# EAGLE design RockBlock_Breakout (EAGLE 9.2.1)
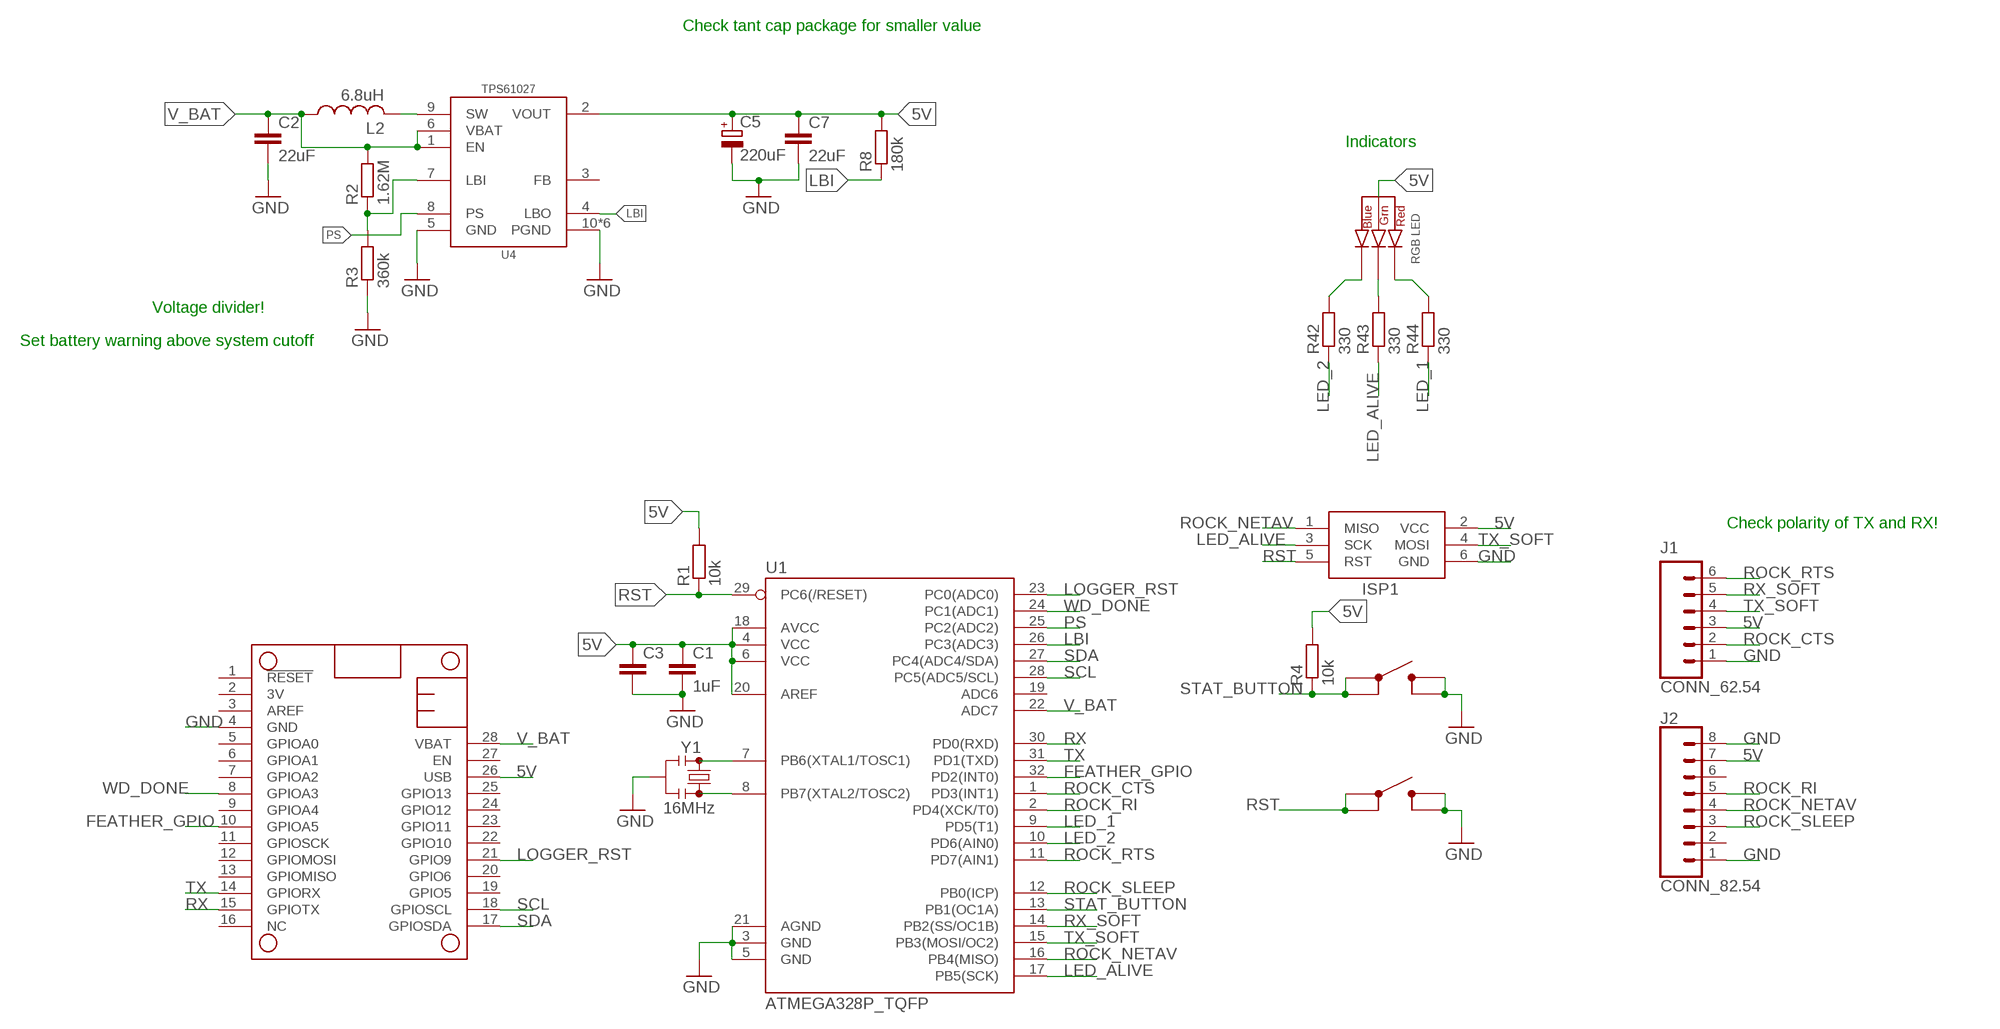
[diagram p0: schematic, sheet 1]

## Parts
C1  1uF  C-EUC0603  [C0603]
C2  22uF  C-EU22UFC0805  [C0805]
C3  C-EUC0402  [C0402]
C5  220uF  CTANT_EU2917  [C2917]
C7  22uF  C-EU22UFC0805  [C0805]
D5  CLVBA-FKA  [CLVBA-FKA]
ISP1  AVRISP-6  [AVRISP]
J1  CONN_62.54  [1X06]
J2  CONN_82.54  [1X08]
L2  6.8uH  INDUCTORTPC_4.8X4.8  [WE-TPC(4.8X4.8)]
MS1  FEATHERWINGLAYOUT  [FEATHERWING_MIN]
R1  10k  R-EU_R0402  [R0402]
R2  1.62M  R-EU_1.62MR0603  [R0603]
R3  360k  R-EU_360KR0603  [R0603]
R4  10k  R-EU_R0402  [R0402]
R8  180k  R-EU_180KR0603  [R0603]
R42  330  R-EU_330R0402  [R0402]
R43  330  R-EU_330R0402  [R0402]
R44  330  R-EU_330R0402  [R0402]
S1  BUTTON4.2X3.2  [SWITCH_4.2X3.2]
S2  BUTTON4.2X3.2  [SWITCH_4.2X3.2]
U1  ATMEGA328P_TQFP  [TQFP32-08]
U4  TPS61027DRC  [DRC0010J]
Y1  16MHz  RESONATOR16MHZSMD_3.2X1.3  [RESONATOR-SMD-3.2X1.3]

## Nets
5V: C1.1 C3.1 C5.+ C7.1 D5.2(ANODE) ISP1.2(VCC) J1.3 J2.7 MS1.26(USB) R1.2 R4.2 R8.2 U1.4(VCC) U1.6(VCC) U1.18(AVCC) U1.20(AREF) U4.2(VOUT)
FEATHER_GPIO: MS1.10(GPIOA5) U1.32(PD2(INT0))
GND: C1.2 C2.2 C3.2 C5.- C7.2 ISP1.6(GND) J1.1 J2.1 J2.8 MS1.4(GND) R3.1 S1.3 S1.4 S2.3 S2.4 U1.3(GND) U1.5(GND) U1.21(AGND) U4.5(GND) U4.10(PGND) U4.EP@1(PGND) U4.EP@2(PGND) U4.EP@3(PGND) U4.EP@4(PGND) U4.EP@5(PGND) Y1.2
LBI: R8.1 U1.26(PC3(ADC3)) U4.4(LBO)
LED_1: R44.1 U1.9(PD5(T1))
LED_2: R42.1 U1.10(PD6(AIN0))
LED_ALIVE: ISP1.3(SCK) R43.1 U1.17(PB5(SCK))
LOGGER_RST: MS1.21(GPIO9) U1.23(PC0(ADC0))
N$2: U1.7(PB6(XTAL1/TOSC1)) Y1.1
N$3: U1.8(PB7(XTAL2/TOSC2)) Y1.3
N$4: R2.1 R3.2 U4.7(LBI)
N$5: L2.2 U4.9(SW)
N$58: D5.3(BLUE_CATH) R42.2
N$59: D5.4(GREEN_CATH) R43.2
N$60: D5.1(RED_CATH) R44.2
PS: U1.25(PC2(ADC2)) U4.8(PS)
ROCK_CTS: J1.2 U1.1(PD3(INT1))
ROCK_NETAV: ISP1.1(MISO) J2.4 U1.16(PB4(MISO))
ROCK_RI: J2.5 U1.2(PD4(XCK/T0))
ROCK_RTS: J1.6 U1.11(PD7(AIN1))
ROCK_SLEEP: J2.3 U1.12(PB0(ICP))
RST: ISP1.5(RST) R1.1 S2.1 S2.2 U1.29(PC6(/RESET))
RX: MS1.15(GPIOTX) U1.30(PD0(RXD))
RX_SOFT: J1.5 U1.14(PB2(SS/OC1B))
SCL: MS1.18(GPIOSCL) U1.28(PC5(ADC5/SCL))
SDA: MS1.17(GPIOSDA) U1.27(PC4(ADC4/SDA))
STAT_BUTTON: R4.1 S1.1 S1.2 U1.13(PB1(OC1A))
TX: MS1.14(GPIORX) U1.31(PD1(TXD))
TX_SOFT: ISP1.4(MOSI) J1.4 U1.15(PB3(MOSI/OC2))
V_BAT: C2.1 L2.1 MS1.28(VBAT) R2.2 U1.22(ADC7) U4.1(EN) U4.6(VBAT)
WD_DONE: MS1.8(GPIOA3) U1.24(PC1(ADC1))
Unconnected: J2.2 J2.6 MS1.1(!RESET) MS1.2(3V) MS1.3(AREF) MS1.5(GPIOA0) MS1.6(GPIOA1) MS1.7(GPIOA2) MS1.9(GPIOA4) MS1.11(GPIOSCK) MS1.12(GPIOMOSI) MS1.13(GPIOMISO) MS1.16(NC) MS1.19(GPIO5) MS1.20(GPIO6) MS1.22(GPIO10) MS1.23(GPIO11) MS1.24(GPIO12) MS1.25(GPIO13) MS1.27(EN) U1.19(ADC6) U4.3(FB)

## Notes on the sheet
- Check tant cap package for smaller value
- Indicators
- Voltage divider!
- Set battery warning above system cutoff
- Check polarity of TX and RX!

## Library data of the parts
C1 C3 = bschulz_passives:C-EU: CAPACITOR, European symbol
C2 C7 = bschulz_passives:C-EU: CAPACITOR, European symbol; DIGIKEY: 490-9952-1-ND; MF: Murata; MPN: GRM219R61C226ME15L
C5 = bschulz_passives:CTANT_EU: Genaric Tantalum Capacitor; DIGIKEY: 478-5408-1-ND; MF: AVX; MPN: TPSY227K010R0100
D5 = bschulz:CLVBA-FKA: Cree RGB LED, Small Package, Common Anode, CLVBA-FKA Digikey: https://www.digikey.com/product-detail/en/cree-inc/CLVBA-FKA-CAEDH8BBB7A363/CLVBA-FKA-CAEDH8BBB7A363CT-ND/2650500; DIGIKEY: CLVBA-FKA-CAEDH8BBB7A363CT-ND; MF: Cree; MPN: CLVBA-FKA-CAEDH8BBB7A363
ISP1 = bschulz:AVRISP: AVR ISP HEADER Standard 6 pin header for AVR programming
J1 = bschulz:CONN_6: Genaric 6 pin header
J2 = bschulz:CONN_8: Genaric 8 pin header
L2 = bschulz:INDUCTOR: Genaric inductor; DIGIKEY: 732-1023-1-ND; MF: Wurth; MPN: 744042006
MS1 = bschulz:FEATHERWING
R1 R4 = bschulz_passives:R-EU_: RESISTOR, European symbol Digikey Parts: Yageo, 0402 <https://www.digikey.com/products/en/resistors/chip-resistor-surface-mount/52?k=&pkeyword=&sf=0&FV=ffec1104%2Cfffc000d%2C1c0002%2C440067%2C1f140000%2Cffe00034%2C400004&quantity=&ColumnSort=0&page=1&stock=1&pageSize=25> Yageo, 0603 <https://www.digikey.com/products/en/resistors/chip-resistor-surface-mount/52?k=&pkeyword=&s=4356&s=47360&sf=0&FV=fffc000d%2C1c0002%2C142c040c%2C1f140000%2Cffe00034&quantity=10&ColumnSort=1000011&page=1&stock=1&pageSize=25> Panasonic, 0603 <https://www.digikey.com/products/en/resistors/chip-resistor-surface-mount/52?k=&pkeyword=&pv252=68&sf=0&FV=ffec373d%2C1c0002%2C142c040c%2C1f140000%2Cffe00034%2C80002%2Cc0001&quantity=&ColumnSort=0&page=1&stock=1&pageSize=25> Panasonic, precision, 0603 <https://www.digikey.com/products/en/resistors/chip-resistor-surface-mount/52?FV=ffec4907%2Cfffc000a%2Cc0172%2C142c040c%2C1f140000%2Cffe00034%2C1c0002&quantity=100&ColumnSort=2085&page=1&stock=1&pageSize=25> Panasonic, 0805 <https://www.digikey.com/products/en/resistors/chip-resistor-surface-mount/52?k=&pkeyword=&pv3=1&sf=0&FV=ffec373d%2C1c0002%2C1f140000%2Cffe00034%2C142c040d&quantity=&ColumnSort=0&page=1&stock=1&pageSize=25> Rohm, current sense <https://www.digikey.com/products/en/resistors/chip-resistor-surface-mount/52?k=&pkeyword=&pv3=1&sf=0&FV=ffecb688%2C1f140000%2Cffe00034%2C1c0002&quantity=&ColumnSort=0&page=1&stock=1&pageSize=25> Vishay, pulse proof automotive <https://www.digikey.com/products/en/resistors/chip-resistor-surface-mount/52?k=&pkeyword=&pv7=2&sf=0&FV=ffec5d6b%2Cffe00034%2C1f140000&quantity=&ColumnSort=0&page=1&stock=1&pageSize=25>; MF: Yageo
R2 = bschulz_passives:R-EU_: RESISTOR, European symbol Digikey Parts: Yageo, 0402 <https://www.digikey.com/products/en/resistors/chip-resistor-surface-mount/52?k=&pkeyword=&sf=0&FV=ffec1104%2Cfffc000d%2C1c0002%2C440067%2C1f140000%2Cffe00034%2C400004&quantity=&ColumnSort=0&page=1&stock=1&pageSize=25> Yageo, 0603 <https://www.digikey.com/products/en/resistors/chip-resistor-surface-mount/52?k=&pkeyword=&s=4356&s=47360&sf=0&FV=fffc000d%2C1c0002%2C142c040c%2C1f140000%2Cffe00034&quantity=10&ColumnSort=1000011&page=1&stock=1&pageSize=25> Panasonic, 0603 <https://www.digikey.com/products/en/resistors/chip-resistor-surface-mount/52?k=&pkeyword=&pv252=68&sf=0&FV=ffec373d%2C1c0002%2C142c040c%2C1f140000%2Cffe00034%2C80002%2Cc0001&quantity=&ColumnSort=0&page=1&stock=1&pageSize=25> Panasonic, precision, 0603 <https://www.digikey.com/products/en/resistors/chip-resistor-surface-mount/52?FV=ffec4907%2Cfffc000a%2Cc0172%2C142c040c%2C1f140000%2Cffe00034%2C1c0002&quantity=100&ColumnSort=2085&page=1&stock=1&pageSize=25> Panasonic, 0805 <https://www.digikey.com/products/en/resistors/chip-resistor-surface-mount/52?k=&pkeyword=&pv3=1&sf=0&FV=ffec373d%2C1c0002%2C1f140000%2Cffe00034%2C142c040d&quantity=&ColumnSort=0&page=1&stock=1&pageSize=25> Rohm, current sense <https://www.digikey.com/products/en/resistors/chip-resistor-surface-mount/52?k=&pkeyword=&pv3=1&sf=0&FV=ffecb688%2C1f140000%2Cffe00034%2C1c0002&quantity=&ColumnSort=0&page=1&stock=1&pageSize=25> Vishay, pulse proof automotive <https://www.digikey.com/products/en/resistors/chip-resistor-surface-mount/52?k=&pkeyword=&pv7=2&sf=0&FV=ffec5d6b%2Cffe00034%2C1f140000&quantity=&ColumnSort=0&page=1&stock=1&pageSize=25>; DIGIKEY: RMCF0603FT1M62CT-ND; MF: Stackpole; MPN: RMCF0603FT1M62; VALUE_PART: 1.62M
R3 = bschulz_passives:R-EU_: RESISTOR, European symbol Digikey Parts: Yageo, 0402 <https://www.digikey.com/products/en/resistors/chip-resistor-surface-mount/52?k=&pkeyword=&sf=0&FV=ffec1104%2Cfffc000d%2C1c0002%2C440067%2C1f140000%2Cffe00034%2C400004&quantity=&ColumnSort=0&page=1&stock=1&pageSize=25> Yageo, 0603 <https://www.digikey.com/products/en/resistors/chip-resistor-surface-mount/52?k=&pkeyword=&s=4356&s=47360&sf=0&FV=fffc000d%2C1c0002%2C142c040c%2C1f140000%2Cffe00034&quantity=10&ColumnSort=1000011&page=1&stock=1&pageSize=25> Panasonic, 0603 <https://www.digikey.com/products/en/resistors/chip-resistor-surface-mount/52?k=&pkeyword=&pv252=68&sf=0&FV=ffec373d%2C1c0002%2C142c040c%2C1f140000%2Cffe00034%2C80002%2Cc0001&quantity=&ColumnSort=0&page=1&stock=1&pageSize=25> Panasonic, precision, 0603 <https://www.digikey.com/products/en/resistors/chip-resistor-surface-mount/52?FV=ffec4907%2Cfffc000a%2Cc0172%2C142c040c%2C1f140000%2Cffe00034%2C1c0002&quantity=100&ColumnSort=2085&page=1&stock=1&pageSize=25> Panasonic, 0805 <https://www.digikey.com/products/en/resistors/chip-resistor-surface-mount/52?k=&pkeyword=&pv3=1&sf=0&FV=ffec373d%2C1c0002%2C1f140000%2Cffe00034%2C142c040d&quantity=&ColumnSort=0&page=1&stock=1&pageSize=25> Rohm, current sense <https://www.digikey.com/products/en/resistors/chip-resistor-surface-mount/52?k=&pkeyword=&pv3=1&sf=0&FV=ffecb688%2C1f140000%2Cffe00034%2C1c0002&quantity=&ColumnSort=0&page=1&stock=1&pageSize=25> Vishay, pulse proof automotive <https://www.digikey.com/products/en/resistors/chip-resistor-surface-mount/52?k=&pkeyword=&pv7=2&sf=0&FV=ffec5d6b%2Cffe00034%2C1f140000&quantity=&ColumnSort=0&page=1&stock=1&pageSize=25>; DIGIKEY: 311-360KHRCT-ND; MF: Yageo; MPN: RC0603FR-07360KL; VALUE_PART: 360k
R8 = bschulz_passives:R-EU_: RESISTOR, European symbol Digikey Parts: Yageo, 0402 <https://www.digikey.com/products/en/resistors/chip-resistor-surface-mount/52?k=&pkeyword=&sf=0&FV=ffec1104%2Cfffc000d%2C1c0002%2C440067%2C1f140000%2Cffe00034%2C400004&quantity=&ColumnSort=0&page=1&stock=1&pageSize=25> Yageo, 0603 <https://www.digikey.com/products/en/resistors/chip-resistor-surface-mount/52?k=&pkeyword=&s=4356&s=47360&sf=0&FV=fffc000d%2C1c0002%2C142c040c%2C1f140000%2Cffe00034&quantity=10&ColumnSort=1000011&page=1&stock=1&pageSize=25> Panasonic, 0603 <https://www.digikey.com/products/en/resistors/chip-resistor-surface-mount/52?k=&pkeyword=&pv252=68&sf=0&FV=ffec373d%2C1c0002%2C142c040c%2C1f140000%2Cffe00034%2C80002%2Cc0001&quantity=&ColumnSort=0&page=1&stock=1&pageSize=25> Panasonic, precision, 0603 <https://www.digikey.com/products/en/resistors/chip-resistor-surface-mount/52?FV=ffec4907%2Cfffc000a%2Cc0172%2C142c040c%2C1f140000%2Cffe00034%2C1c0002&quantity=100&ColumnSort=2085&page=1&stock=1&pageSize=25> Panasonic, 0805 <https://www.digikey.com/products/en/resistors/chip-resistor-surface-mount/52?k=&pkeyword=&pv3=1&sf=0&FV=ffec373d%2C1c0002%2C1f140000%2Cffe00034%2C142c040d&quantity=&ColumnSort=0&page=1&stock=1&pageSize=25> Rohm, current sense <https://www.digikey.com/products/en/resistors/chip-resistor-surface-mount/52?k=&pkeyword=&pv3=1&sf=0&FV=ffecb688%2C1f140000%2Cffe00034%2C1c0002&quantity=&ColumnSort=0&page=1&stock=1&pageSize=25> Vishay, pulse proof automotive <https://www.digikey.com/products/en/resistors/chip-resistor-surface-mount/52?k=&pkeyword=&pv7=2&sf=0&FV=ffec5d6b%2Cffe00034%2C1f140000&quantity=&ColumnSort=0&page=1&stock=1&pageSize=25>; DIGIKEY: P180KHCT-ND; MF: Panasonic; MPN: ERJ-3EKF1803V; VALUE_PART: 180k
R42-R44 = bschulz_passives:R-EU_: RESISTOR, European symbol Digikey Parts: Yageo, 0402 <https://www.digikey.com/products/en/resistors/chip-resistor-surface-mount/52?k=&pkeyword=&sf=0&FV=ffec1104%2Cfffc000d%2C1c0002%2C440067%2C1f140000%2Cffe00034%2C400004&quantity=&ColumnSort=0&page=1&stock=1&pageSize=25> Yageo, 0603 <https://www.digikey.com/products/en/resistors/chip-resistor-surface-mount/52?k=&pkeyword=&s=4356&s=47360&sf=0&FV=fffc000d%2C1c0002%2C142c040c%2C1f140000%2Cffe00034&quantity=10&ColumnSort=1000011&page=1&stock=1&pageSize=25> Panasonic, 0603 <https://www.digikey.com/products/en/resistors/chip-resistor-surface-mount/52?k=&pkeyword=&pv252=68&sf=0&FV=ffec373d%2C1c0002%2C142c040c%2C1f140000%2Cffe00034%2C80002%2Cc0001&quantity=&ColumnSort=0&page=1&stock=1&pageSize=25> Panasonic, precision, 0603 <https://www.digikey.com/products/en/resistors/chip-resistor-surface-mount/52?FV=ffec4907%2Cfffc000a%2Cc0172%2C142c040c%2C1f140000%2Cffe00034%2C1c0002&quantity=100&ColumnSort=2085&page=1&stock=1&pageSize=25> Panasonic, 0805 <https://www.digikey.com/products/en/resistors/chip-resistor-surface-mount/52?k=&pkeyword=&pv3=1&sf=0&FV=ffec373d%2C1c0002%2C1f140000%2Cffe00034%2C142c040d&quantity=&ColumnSort=0&page=1&stock=1&pageSize=25> Rohm, current sense <https://www.digikey.com/products/en/resistors/chip-resistor-surface-mount/52?k=&pkeyword=&pv3=1&sf=0&FV=ffecb688%2C1f140000%2Cffe00034%2C1c0002&quantity=&ColumnSort=0&page=1&stock=1&pageSize=25> Vishay, pulse proof automotive <https://www.digikey.com/products/en/resistors/chip-resistor-surface-mount/52?k=&pkeyword=&pv7=2&sf=0&FV=ffec5d6b%2Cffe00034%2C1f140000&quantity=&ColumnSort=0&page=1&stock=1&pageSize=25>; DIGIKEY: 311-330LRCT-ND; MF: Yageo; MPN: RC0603FR-07330RL; VALUE_PART: 330
S1 S2 = bschulz:BUTTON: Genaric SPST Pushbutton; DIGIKEY: CKN10504CT-ND; MF: C&K; MPN: PTS810 SJG 250 SMTR LFS
U1 = bschulz:ATMEGA328P_TQFP: Popular 328P in QFP Storefront component: ATmega328 - TQFP <https://www.sparkfun.com/products/13448> (COM-13448) Datasheet <http://www.sparkfun.com/datasheets/Components/SMD/ATMega328.pdf> SparkFun Products SparkFun RedBoard - Programmed with Arduino <https://www.sparkfun.com/products/12757> (DEV-12757) Arduino Pro Mini 328 - 5V/16MHz <https://www.sparkfun.com/products/11113> (DEV-11113) Arduino Pro Mini 328 - 3.3V/8MHz <https://www.sparkfun.com/products/11114> (DEV-11114) SparkFun OpenLog <https://www.sparkfun.com/products/13712> (DEV-13712) SparkFun MicroView - OLED Arduino Module <https://www.sparkfun.com/products/12923> (DEV-12923) SparkFun Digital Sandbox <https://www.sparkfun.com/products/12651> (DEV-12651) SparkFun PicoBoard <https://www.sparkfun.com/products/11888> (WIG-11888) Arduino Fio <https://www.sparkfun.com/products/10116> (DEV-10116) LilyPad Arduino 328 Main Board <https://www.sparkfun.com/products/13342> (DEV-13342) SparkFun RedStick <https://www.sparkfun.com/products/13741> (DEV-13741) LilyPad MP3 <https://www.sparkfun.com/products/11013> (DEV-11013) LilyPad Arduino SimpleSnap <https://www.sparkfun.com/products/10941> (DEV-10941) SparkFun Stepoko <https://www.sparkfun.com/products/13899> (ROB-13899) SparkFun Geiger Counter <https://www.sparkfun.com/products/11345> (SEN-11345) SparkFun EL Sequencer <https://www.sparkfun.com/products/12781> (COM-12781) Arduino Pro 328 - 5V/16MHz <https://www.sparkfun.com/products/10915> (DEV-10915) CryptoCape <https://www.sparkfun.com/products/12773> (DEV-12773) SparkFun IR Thermometer Evaluation Board - MLX90614 <https://www.sparkfun.com/products/10740> (SEN-10740) SparkFun RedBot Mainboard <https://www.sparkfun.com/products/12097> (ROB-12097) Arduino Pro 328 - 3.3V/8MHz <https://www.sparkfun.com/products/10914> (DEV-10914) SparkFun Block for Intel® Edison - Arduino <https://www.sparkfun.com/products/13036> (DEV-13036) SparkFun Simon Says - Surface Mount Soldering Kit <https://www.sparkfun.com/products/10935> (KIT-10935) SparkFun 7-Segment Serial Display - Red <https://www.sparkfun.com/products/11441> (COM-11441) SparkFun 7-Segment Serial Display - White <https://www.sparkfun.com/products/11629> (COM-11629) SparkFun 7-Segment Serial Display - Yellow <https://www.sparkfun.com/products/11443> (COM-11443) SparkFun 7-Segment Serial Display - Kelly Green <https://www.sparkfun.com/products/11440> (COM-11440) SparkFun 7-Segment Serial Display - Blue <https://www.sparkfun.com/products/11442> (COM-11442) SparkFun OpenSegment Serial Display - 20mm (Blue) <https://www.sparkfun.com/products/11647> (COM-11647) SparkFun OpenSegment Serial Display - 20mm (Green) <https://www.sparkfun.com/products/11646> (COM-11646) SparkFun OpenSegment Serial Display - 20mm (White) <https://www.sparkfun.com/products/11648> (COM-11648) SparkFun OpenSegment Serial Display - 20mm (Red) <https://www.sparkfun.com/products/11644> (COM-11644) SparkFun OpenSegment Serial Display - 20mm (Yellow) <https://www.sparkfun.com/products/11645> (COM-11645) SparkFun OpenSegment Shield <https://www.sparkfun.com/products/13190> (DEV-13190); DIGIKEY: ATMEGA328PB-AURCT-ND; MF: Atmel; MPN: ATMEGA328PB-AUR; PROD_ID: IC-09069
U4 = bschulz:TPS6102*: TPS6102x - High Efficiency Synchronous Boost Converter Characteristics: Vin: 0.9V ~ 5.5V Vout: 1.8V ~ 5.5V (Fixed 3.0v, 3.3v, 5v) Output Current (max): 1.5A (Compatable with 1.8A version) IQ: 25μA (typ) Operating Temperature: -40°C to 85°C Digikey: 296-15752-1-ND (TPS61020, Adj) <https://www.digikey.com/product-detail/en/texas-instruments/TPS61020DRCR/296-15752-1-ND/593893> 296-15844-1-ND (TPS61025, 3.3v Fixed) <https://www.digikey.com/product-detail/en/texas-instruments/TPS61025DRCR/296-15844-1-ND/600559> 296-15754-1-ND (TPS61027, 5v Fixed) <https://www.digikey.com/product-detail/en/texas-instruments/TPS61027DRCR/296-15754-1-ND/593896>; DIGIKEY: 296-15754-1-ND; DISP: TPS61027; MF: TI; MPN: TPS61027DRCR
Y1 = bschulz:RESONATOR: 16MHz Resonator Digikey Example <http://www.digikey.com/product-detail/en/murata-electronics-north-america/CSTCE16M0V53-R0/490-1198-1-ND/584635> Frequency: 16MHz Frequency Stability: ±0.3% Frequency Tolerance: ±0.5% Capacitance: 15pF SparkFun Products SparkFun OpenLog <https://www.sparkfun.com/products/13712> SparkFun MicroView - OLED Arduino Module <https://www.sparkfun.com/products/12923>; DIGIKEY: 490-17948-1-ND; MF: Murata; MPN: CSTNE16M0V530000R0

## Board
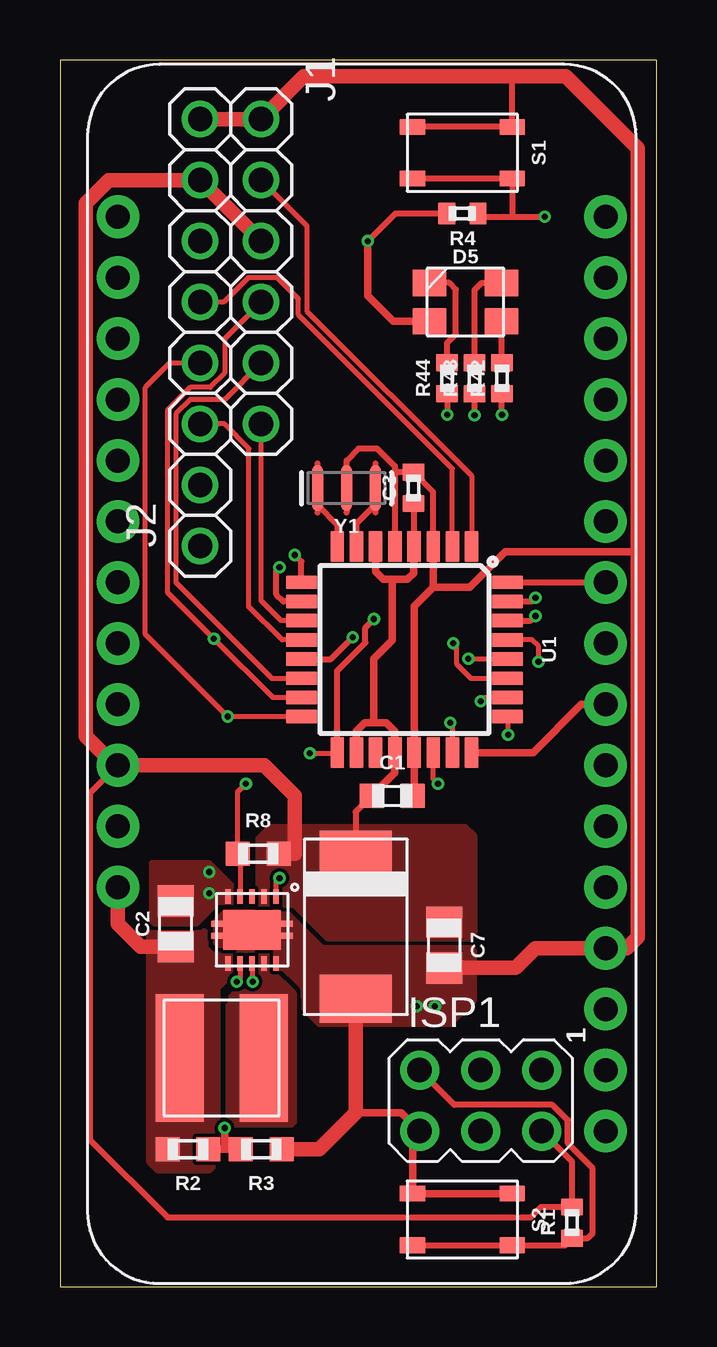
[diagram p1: board, top side]
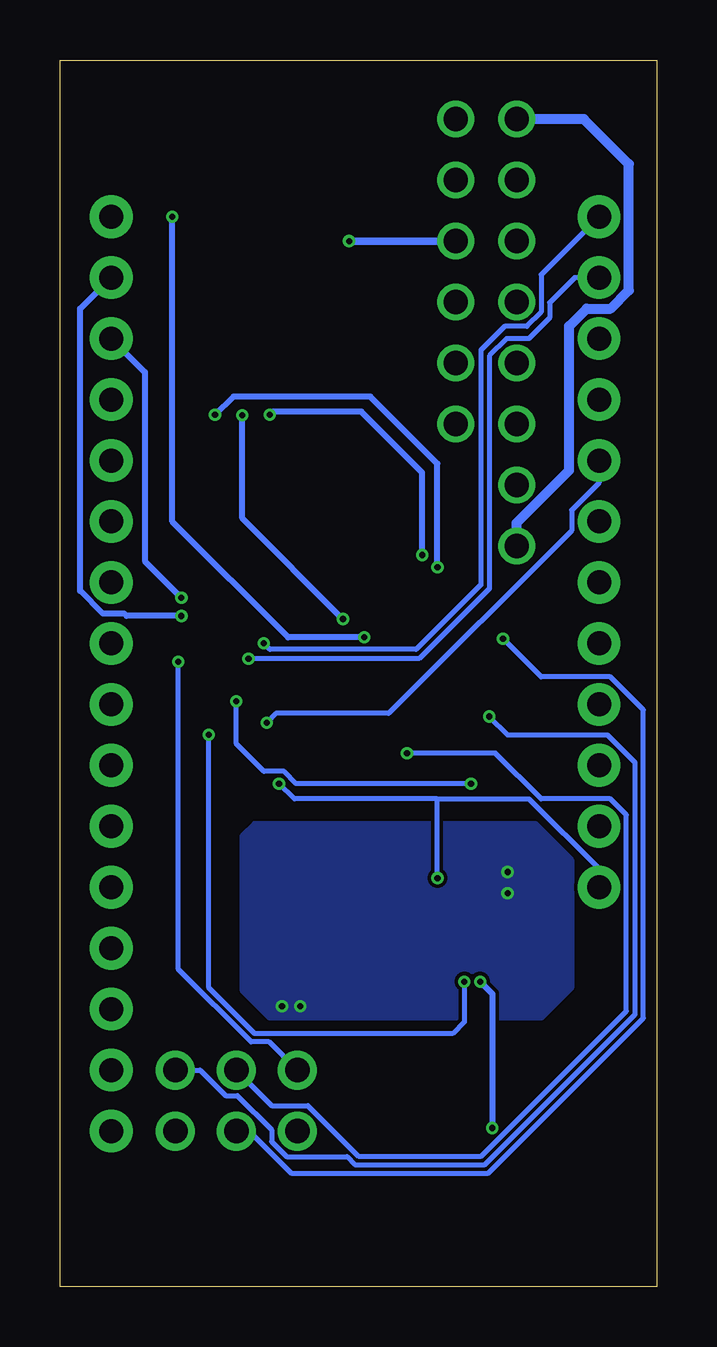
[diagram p2: board, bottom side, seen from below]

Size 24.87 x 51.1 mm. Coordinates in mm from the lower left corner, seen from the top.
Outline: 0,0 24.87,0 24.87,51.1 0,51.1 0,0
Copper layers (1*16): Top 0.035559375mm / dielectric 1.6mm / Bottom 0.035559375mm
Design rules "oshpark-2layer": minimum track width 6mil, minimum drill 10mil, track to track 6mil, track to pad 6mil, pad to pad 6mil, via to via 6mil, smd to smd 6mil, copper to edge 15mil, drill to drill 6mil, minimum pad ring 5mil, minimum via ring 5mil, stop-mask expansion 2.5mil, vias tented up to drill 0mil, thermal gap 10mil

### Footprints (pad centres in the part's own frame; a part is rotated, then mirrored left to right if it is on the bottom)
C0603 = smd 1 x 1: 1 -0.85,0; 2 0.85,0
C0805 = smd 1.3 x 1.5: 1 -0.95,0; 2 0.95,0
C0402 = smd 0.7 x 0.9: 1 -0.65,0; 2 0.65,0
C2917 = smd 2 x 3: + -3,0; - 3,0
CLVBA-FKA = smd 1.4 x 1.1: 1 -1.5,0.8; 2 -1.5,-0.8; 3 1.5,-0.8; 4 1.5,0.8
AVRISP = drill 1.02 pad 1.626: 1 -1.27,2.54; 2 1.27,2.54; 3 -1.27,0; 4 1.27,0; 5 -1.27,-2.54; 6 1.27,-2.54
1X06 = drill 1.016: 1 -6.35,0; 2 -3.81,0; 3 -1.27,0; 4 1.27,0; 5 3.81,0; 6 6.35,0
1X08 = drill 1.016: 1 -8.89,0; 2 -6.35,0; 3 -3.81,0; 4 -1.27,0; 5 1.27,0; 6 3.81,0; 7 6.35,0; 8 8.89,0
WE-TPC(4.8X4.8) = smd 5.3 x 2: 1 0,1.75; 2 0,-1.75
FEATHERWING_MIN = drill 1 pad 1.778: 1 6.35,1.27; 2 8.89,1.27; 3 11.43,1.27; 4 13.97,1.27; 5 16.51,1.27; 6 19.05,1.27; 7 21.59,1.27; 8 24.13,1.27; 9 26.67,1.27; 10 29.21,1.27; 11 31.75,1.27; 12 34.29,1.27; 13 36.83,1.27; 14 39.37,1.27; 15 41.91,1.27; 16 44.45,1.27; 17 44.45,21.59; 18 41.91,21.59; 19 39.37,21.59; 20 36.83,21.59; 21 34.29,21.59; 22 31.75,21.59; 23 29.21,21.59; 24 26.67,21.59; 25 24.13,21.59; 26 21.59,21.59; 27 19.05,21.59; 28 16.51,21.59
R0402 = smd 0.7 x 0.9: 1 -0.65,0; 2 0.65,0
R0603 = smd 1 x 1: 1 -0.85,0; 2 0.85,0
SWITCH_4.2X3.2 = smd 1.05 x 0.65: 1 -2.075,1.075; 2 2.075,1.075; 3 -2.075,-1.075; 4 2.075,-1.075
TQFP32-08 = smd 1.27 x 0.559: 1 -4.293,2.8; 2 -4.293,2; 3 -4.293,1.2; 4 -4.293,0.4; 5 -4.293,-0.4; 6 -4.293,-1.2; 7 -4.293,-2; 8 -4.293,-2.8; 17 4.293,-2.8; 18 4.293,-2; 19 4.293,-1.2; 20 4.293,-0.4; 21 4.293,0.4; 22 4.293,1.2; 23 4.293,2; 24 4.293,2.8 | smd 0.559 x 1.27: 9 -2.8,-4.293; 10 -2,-4.293; 11 -1.2,-4.293; 12 -0.4,-4.293; 13 0.4,-4.293; 14 1.2,-4.293; 15 2,-4.293; 16 2.8,-4.293; 25 2.8,4.293; 26 2,4.293; 27 1.2,4.293; 28 0.4,4.293; 29 -0.4,4.293; 30 -1.2,4.293; 31 -2,4.293; 32 -2.8,4.293
DRC0010J = smd 0.6 x 0.24: 1 -1.4,1; 2 -1.4,0.5; 3 -1.4,0; 4 -1.4,-0.5; 5 -1.4,-1; 6 1.4,-1; 7 1.4,-0.5; 8 1.4,0; 9 1.4,0.5; 10 1.4,1 | smd 1.65 x 2.4: EP@1 0,0 | smd 0.25 x 0.5: EP@2 -0.25,1.45; EP@3 0.25,1.45; EP@4 -0.25,-1.45; EP@5 0.25,-1.45
RESONATOR-SMD-3.2X1.3 = smd 0.45 x 1.905: 1 -1.2,0; 2 0,0; 3 1.2,0

### Placement (x,y rotation side)
C1  13.84,20.45 0 top
C2  4.83,15.11 90 top
C3  14.73,33.27 90 top
C5  12.32,14.99 270 top
C7  16,14.22 270 top
D5  16.89,41.02 0 top
ISP1  17.53,7.75 270 top
J1  8.38,42.29 270 top
J2  5.84,39.75 90 top
L2  6.73,9.53 90 top
MS1  24,0.13 90 top
R1  21.34,2.67 90 top
R2  5.33,5.71 180 top
R3  8.38,5.71 180 top
R4  16.76,44.7 180 top
R8  8.25,18.03 0 top
R42  18.42,37.85 90 top
R43  17.27,37.85 90 top
R44  16.13,37.85 90 top
S1  16.76,47.24 180 top
S2  16.76,2.79 180 top
U1  14.35,26.54 270 top
U4  8,14.86 270 top
Y1  11.94,33.27 180 top

### Tracks (layer width: path | path; a pad name or v marks a point on that pad's centre or on a via)
5V  (via drill 0.25)
  Top 0.254: C3.1 14.73,30.86 U1.4 | ISP1.2 21.34,5.21 R1.2 20.04,3.32 19.61,2.88 4.48,2.88 1.25,6.12 1.25,20.55 MS1.26 | C1.1 12.32,19.77 C5.+ | R4.2 13.97,44.7 v12.83,43.56
  Top 0.305: U1.6 13.15,29.77 13.46,29.46 13.84,29.46 | 13.84,29.46 14.48,29.46 14.73,29.72 14.73,30.86 | 13.08,23.5 13.59,23.5 13.95,23.13 U1.20 13.95,21.41 C1.1 | 13.08,23.5 12.7,23.5 12.35,23.15 U1.18 | 13.84,29.46 13.84,26.92 13.08,26.16 13.08,23.5 | v12.83,43.56 12.83,41.27 13.88,40.22 D5.2
  Top 0.61: R8.2 9.78,18.03 9.78,20.45 8.51,21.72 MS1.26 2.29,21.72 1.07,22.94 1.07,45.13 2.03,46.1 J2.7 J1.3
  Bottom 0.305: J1.3 v12.83,43.56
  pour Top (no thermals): 8.25,15.88 8.25,18.67 8.76,19.18 16.89,19.18 17.27,18.8 17.27,14.73 17.02,14.48 11.18,14.48 9.78,15.88
FEATHER_GPIO
  Top 0.254: U1.32 MS1.10
GND  (via drill 0.25)
  Top 0.254: Y1.2 11.94,34.42 12.45,34.92 13.21,34.92 13.95,34.18 13.95,33.91 | 13.95,33.91 U1.5 | 13.95,33.91 13.97,33.92 C3.2 15.55,33.1 U1.3 | S1.4 S1.3 18.84,50.38 18.8,50.42
  Top 0.305: 15.55,29.14 U1.3 | 15.55,29.14 14.75,28.34 U1.21 14.75,20.5 C1.2 | 12.32,7.24 14.22,7.24 ISP1.6 14.69,6.18 S2.4 S2.3 | 24.08,30.61 18.54,30.61 17.08,29.14 15.55,29.14
  Top 0.61: C7.2 18.99,13.27 19.81,14.1 MS1.4 23.62,14.1 24.08,14.55 24.08,30.61 24.08,47.42 21.08,50.42 18.8,50.42 10.16,50.42 J1.1 J2.8 | R3.1 10.79,5.71 12.32,7.24 C5.-
  Bottom 0.406: J2.1 5.84,31.82 3.66,34.01 3.66,40.01 2.93,40.74 1.93,40.74 1.17,41.5 1.17,46.76 3.05,48.64 J2.8
  other vias: 6.22,17.27 6.22,16.38 14.86,11.68 15.62,11.68
  pour Top (no thermals): 3.81,17.65 3.81,15.24 3.94,15.11 5.71,15.11 6.6,16 7.24,16 7.24,16.64 6.22,17.65
  pour Top (rank 4, no thermals): 8.76,13.84 8.76,13.21 8.89,13.08 9.14,13.08 10.16,12.06 10.16,11.56 10.79,10.92 16.26,10.92 17.27,11.94 17.27,13.97 17.02,14.22 11.18,14.22 9.78,15.62 6.86,15.62 6.48,15.24 6.48,14.1 6.73,13.84
  pour Bottom (no thermals): 3.56,17.78 3.56,12.45 4.83,11.18 16.13,11.18 17.27,12.32 17.27,18.8 16.76,19.3 5.08,19.3
LBI  (via drill 0.25)
  Top 0.2: U4.4 7.5,17.94 R8.1 7.41,20.61 v7.75,20.95 | v17.53,24.38 17.69,24.54 U1.26
  Bottom 0.2: v17.53,24.38 17.53,22.61 16.38,21.46 15.54,21.46 15.03,20.95 v7.75,20.95
LED_1  (via drill 0.25)
  Top 0.254: U1.9 10.06,30.2 v9.78,30.48 | R44.1 v16.13,36.32
  Bottom 0.254: v9.78,30.48 9.78,33.91 12.32,36.45 16,36.45 v16.13,36.32
LED_2  (via drill 0.25)
  Top 0.254: U1.10 9.3,28.54 9.02,28.83 9.02,29.84 v9.14,29.97 | v18.42,36.32 R42.1
  Bottom 0.254: v9.14,29.97 9.14,34.29 11.94,37.08 17.65,37.08 v18.42,36.32
LED_ALIVE  (via drill 0.25)
  Top 0.2: v10.41,22.23 11.53,22.23 U1.17
  Top 0.254: v13.08,27.81 12.72,27.46 12.72,26.83 11.55,25.65 U1.17 | v17.27,36.3 R43.1
  Bottom 0.2: ISP1.3 16.05,7.54 14.54,7.54 12.43,5.43 7.31,5.43 1.27,11.47 1.27,19.65 1.94,20.32 4.82,20.32 6.73,22.23 v10.41,22.23
  Bottom 0.254: v13.08,27.81 17.27,32 v17.27,36.3
LOGGER_RST  (via drill 0.25)
  Top 0.2: v16.26,23.5 16.35,23.4 U1.23
  Bottom 0.2: MS1.21 2.41,33.49 3.55,32.35 3.55,31.5 11.18,23.88 15.87,23.88 v16.26,23.5
N$2
  Top 0.254: Y1.1 13.14,32.57 12.35,31.78 U1.7
N$3
  Top 0.254: Y1.3 10.74,32.57 11.56,31.75 11.55,31.74 U1.8
N$4  (via drill 0.25)
  Top 0.2: U4.7 7.5,12.84 v7.37,12.7
  Top 0.305: R2.1 6.86,5.71 | 6.86,5.71 R3.2 | v6.86,6.6 6.86,5.71
  Bottom 0.254: v7.37,12.7 6.86,12.19 v6.86,6.6
N$5
  pour Top (rank 3, no thermals): 8.25,13.84 8.25,13.21 7.11,12.06 7.11,11.81 6.99,11.68 6.99,6.86 7.11,6.73 9.65,6.73 9.78,6.86 9.78,12.19 8.76,13.21 8.76,13.84
N$58
  Top 0.254: R42.2 18.42,40.2 D5.3
N$59
  Top 0.254: R43.2 17.27,41.53 17.56,41.82 D5.4
N$60
  Top 0.254: R44.2 16.13,39.31 16.5,39.68 16.5,41.54 16.22,41.82 D5.1
PS  (via drill 0.25)
  Top 0.2: U4.8 8,12.72 v8.03,12.7 | v18.67,22.99 18.67,23.72 U1.25
  Bottom 0.2: v8.03,12.7 8.03,11.02 8.51,10.54 16.76,10.54 18.67,12.45 v18.67,22.99
ROCK_CTS
  Top 0.2: J1.2 10.29,44.2 10.29,40.64 17.15,33.78 U1.1
ROCK_NETAV  (via drill 0.25)
  Top 0.2: U1.16 v6.99,23.74 v6.99,23.75 3.56,27.18 3.56,37.47 4.57,38.48 J2.4
  Bottom 0.2: ISP1.1 19.03,9.02 17.97,7.95 17.48,7.95 16.05,6.53 16.05,6.04 15.43,5.41 12.91,5.41 12.58,5.08 7.17,5.08 0.92,11.33 0.92,21.84 2.07,22.99 6.22,22.99 v6.99,23.75
ROCK_RI
  Top 0.2: U1.2 16.35,34.08 9.93,40.49 9.93,41.16 9.06,42.03 7.83,42.03 6.82,41.02 J2.5
ROCK_RTS
  Top 0.2: U1.11 9.21,27.74 8.38,28.57 J1.6
ROCK_SLEEP
  Top 0.2: U1.12 9.25,26.94 7.87,28.32 7.87,34.92 6.86,35.94 J2.3
RST  (via drill 0.25)
  Top 0.2: v19.94,26.04 19.94,26.67 19.67,26.94 U1.29
  Top 0.254: S2.2 S2.1 21.04,1.72 R1.1 21.99,2.02 22.19,2.22 22.19,4.92 21.16,5.96 21.16,6.93 20.52,7.57 16.43,7.57 ISP1.5
  Bottom 0.2: ISP1.5 16.16,10.19 16.91,10.19 19.94,13.22 v19.94,26.04
RX  (via drill 0.25)
  Top 0.254: U1.30 19.62,27.74 v19.81,27.94
  Bottom 0.254: v19.81,27.94 22.1,27.94 22.2,28.04 23.09,28.04 24.03,28.98 24.03,40.74 MS1.15
RX_SOFT
  Top 0.2: J1.5 6.86,36.96 5.42,36.96 4.83,36.36 4.83,29.34 8.82,25.34 U1.14
SCL  (via drill 0.25)
  Top 0.2: v17.02,26.16 18.62,26.16 U1.28
  Bottom 0.2: v17.02,26.16 9.91,26.16 6.99,29.08 6.99,38.77 6.26,39.49 5.34,39.49 4.48,40.36 4.48,40.99 3.43,42.04 MS1.18
SDA  (via drill 0.25)
  Top 0.2: v16.38,26.8 16.51,26.67 16.51,25.95 17.12,25.34 U1.27
  Bottom 0.2: MS1.17 4.83,42.16 4.83,40.6 5.42,40.01 6.35,40.01 7.34,39.02 7.34,29.24 10.03,26.54 16.13,26.54 v16.38,26.8
STAT_BUTTON  (via drill 0.25)
  Top 0.254: U1.13 11.29,26.14 v12.19,27.05 | R4.1 17.54,44.58 18.8,44.58 | 18.8,44.58 v20.19,44.58 | S1.2 S1.1 18.84,44.62 18.8,44.58
  Bottom 0.254: v12.19,27.05 15.37,27.05 20.19,31.88 v20.19,44.58
TX  (via drill 0.25)
  Top 0.254: U1.31 19.65,28.54 v19.81,28.7
  Bottom 0.254: MS1.14 21.34,38.1 21.34,30.23 v19.81,28.7
TX_SOFT  (via drill 0.25)
  Top 0.2: J1.4 6.86,39.49 6.86,38.06 6.26,37.47 5.44,37.47 4.48,36.51 4.48,28.93 v6.41,26.99 8.86,24.54 U1.15
  Bottom 0.2: ISP1.4 16.99,6.48 15.24,4.73 7.02,4.73 0.57,11.18 0.57,24.02 1.94,25.4 4.82,25.4 v6.41,26.99
V_BAT  (via drill 0.25)
  Top 0.2: U4.1 9,16.88 v9.14,17.02 | v15.75,20.95 15.55,21.15 U1.22
  Top 0.61: MS1.28 2.41,15.11 3.36,14.16 C2.1
  Bottom 0.2: v9.14,17.02 9.14,20.32 | v15.75,20.95 15.11,20.32 9.14,20.32 | 9.14,20.32 5.33,20.32 2.41,17.4 MS1.28
  pour Top (rank 2, no thermals): 7.11,13.84 6.35,13.84 6.1,14.1 6.1,14.73 5.84,14.99 3.68,14.99 3.68,5.21 4.06,4.83 6.22,4.83 6.6,5.21 6.6,12.45 7.11,12.95
WD_DONE
  Top 0.305: U1.24 19.71,22.25 21.72,24.26 MS1.8